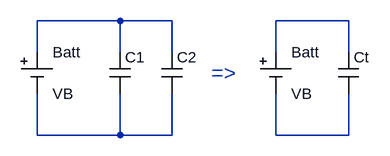
[diagram p0: schematic Parallel Network.asc]
Parallel Network.asc, the LTspice schematic file:
Version 4
SHEET 1 880 680
WIRE 112 80 -16 80
WIRE 192 80 112 80
WIRE 464 80 352 80
WIRE -16 128 -16 80
WIRE 112 128 112 80
WIRE 192 128 192 80
WIRE 352 128 352 80
WIRE 464 128 464 80
WIRE -16 256 -16 192
WIRE 112 256 112 192
WIRE 112 256 -16 256
WIRE 192 256 192 192
WIRE 192 256 112 256
WIRE 352 256 352 192
WIRE 464 256 464 192
WIRE 464 256 352 256
SYMBOL cap 96 128 R0
SYMATTR InstName C1
SYMATTR Value ""
SYMBOL cap 176 128 R0
SYMATTR InstName C2
SYMATTR Value ""
SYMBOL cap 448 128 R0
SYMATTR InstName Ct
SYMATTR Value ""
SYMBOL Misc\\cell -16 128 R0
SYMATTR InstName Batt
SYMATTR Value VB
SYMBOL Misc\\cell 352 128 R0
SYMATTR InstName Batt
SYMATTR Value VB
TEXT 272 160 Center 3 ;=>

The netlist it stands for:
* Parallel Network.asc
C1 N001 N003
C2 N001 N003
Ct N002 N004
V§Batt N001 N003 VB
V§Batt N002 N004 VB
* =>
.backanno
.end